# EAGLE schematic task_3 (EAGLE 9.5.2)
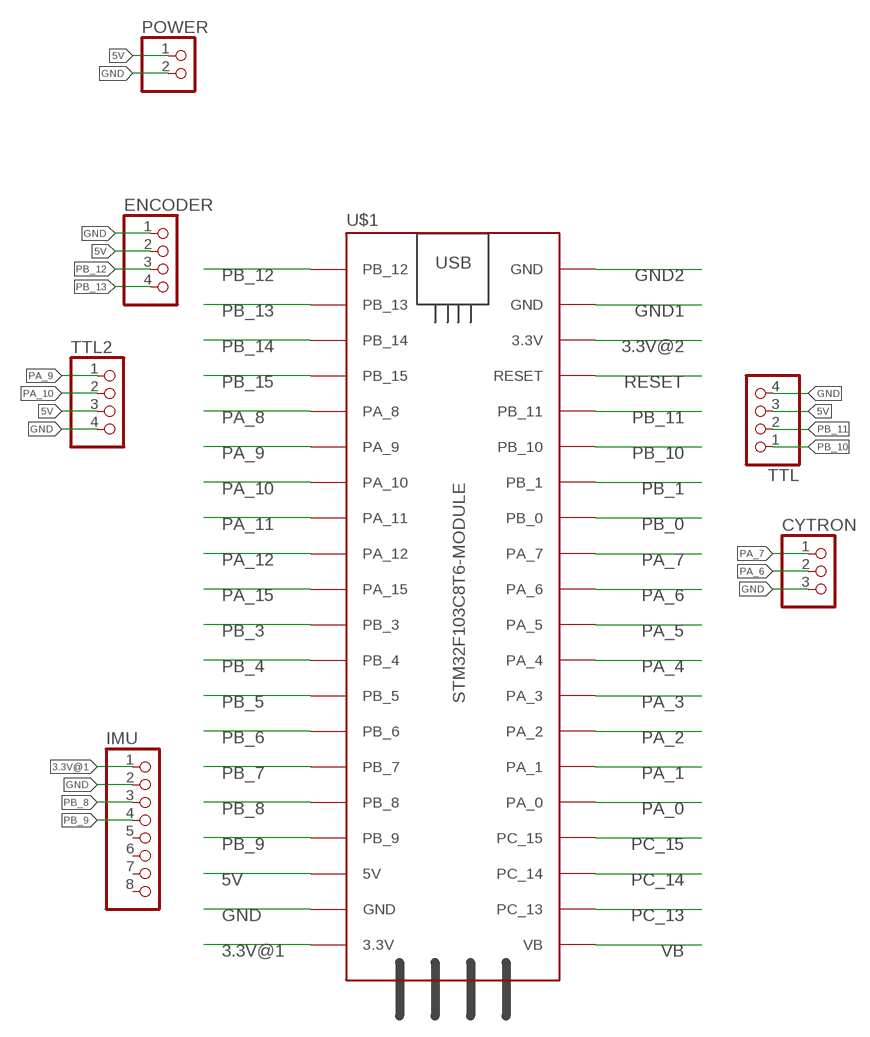
[diagram p0: schematic, sheet 1]

## Parts
CYTRON  PINHD-3_DATA  [1X03_DATA]
ENCODER  PINHD-4_DATA  [1X04_DATA]
IMU  PINHD-1X8  [1X08]
POWER  PINHD-2_DATA  [1X02_DATA]
TTL  PINHD-4_DATA  [1X04_DATA]
TTL2  PINHD-4_DATA  [1X04_DATA]
U$1  STM32F103C8T6-MODULE  [STM32F103C8T6-MODULE]

## Nets
3.3V@1: IMU.1 U$1.3.3V_1(3.3V)
3.3V@2: U$1.3.3V_2(3.3V)
5V: ENCODER.2 POWER.1 TTL2.3 TTL.3 U$1.5V
GND: CYTRON.3 ENCODER.1 IMU.2 POWER.2 TTL2.4 TTL.4 U$1.GND_1(GND)
GND1: U$1.GND_2(GND)
GND2: U$1.GND_3(GND)
PA_0: U$1.PA_0
PA_1: U$1.PA_1
PA_2: U$1.PA_2
PA_3: U$1.PA_3
PA_4: U$1.PA_4
PA_5: U$1.PA_5
PA_6: CYTRON.2 U$1.PA_6
PA_7: CYTRON.1 U$1.PA_7
PA_8: U$1.PA_8
PA_9: TTL2.1 U$1.PA_9
PA_10: TTL2.2 U$1.PA_10
PA_11: U$1.PA_11
PA_12: U$1.PA_12
PA_15: U$1.PA_15
PB_0: U$1.PB_0
PB_1: U$1.PB_1
PB_3: U$1.PB_3
PB_4: U$1.PB_4
PB_5: U$1.PB_5
PB_6: U$1.PB_6
PB_7: U$1.PB_7
PB_8: IMU.3 U$1.PB_8
PB_9: IMU.4 U$1.PB_9
PB_10: TTL.1 U$1.PB_10
PB_11: TTL.2 U$1.PB_11
PB_12: ENCODER.3 U$1.PB_12
PB_13: ENCODER.4 U$1.PB_13
PB_14: U$1.PB_14
PB_15: U$1.PB_15
PC_13: U$1.PC_13
PC_14: U$1.PC_14
PC_15: U$1.PC_15
RESET: U$1.RESET
VB: U$1.VB
Unconnected: IMU.5 IMU.6 IMU.7 IMU.8

## Library data of the parts
CYTRON = MIA_LIBRARY-2-2-2:PINHD-3_DATA: PIN HEADER
ENCODER TTL TTL2 = MIA_LIBRARY-2-2-2:PINHD-4_DATA: PIN HEADER
IMU = MIA_LIBRARY-2-2-2:PINHD-1X8: PIN HEADER
POWER = MIA_LIBRARY-2-2-2:PINHD-2_DATA: PIN HEADER
U$1 = MIA_LIBRARY-2-2-2:STM32F103C8T6-MODULE: STM32F103C8T6 module with ARM Cortex-3, 20kB SRAM, 64kB Flash, 72MHz